# Altium schematic sheet S08.SchDoc: IEEE-1394/Ethernet FPGA Controller
size 381 x 254 mm; Revision: 3.2; SheetNumber: 8; SheetTotal: 10
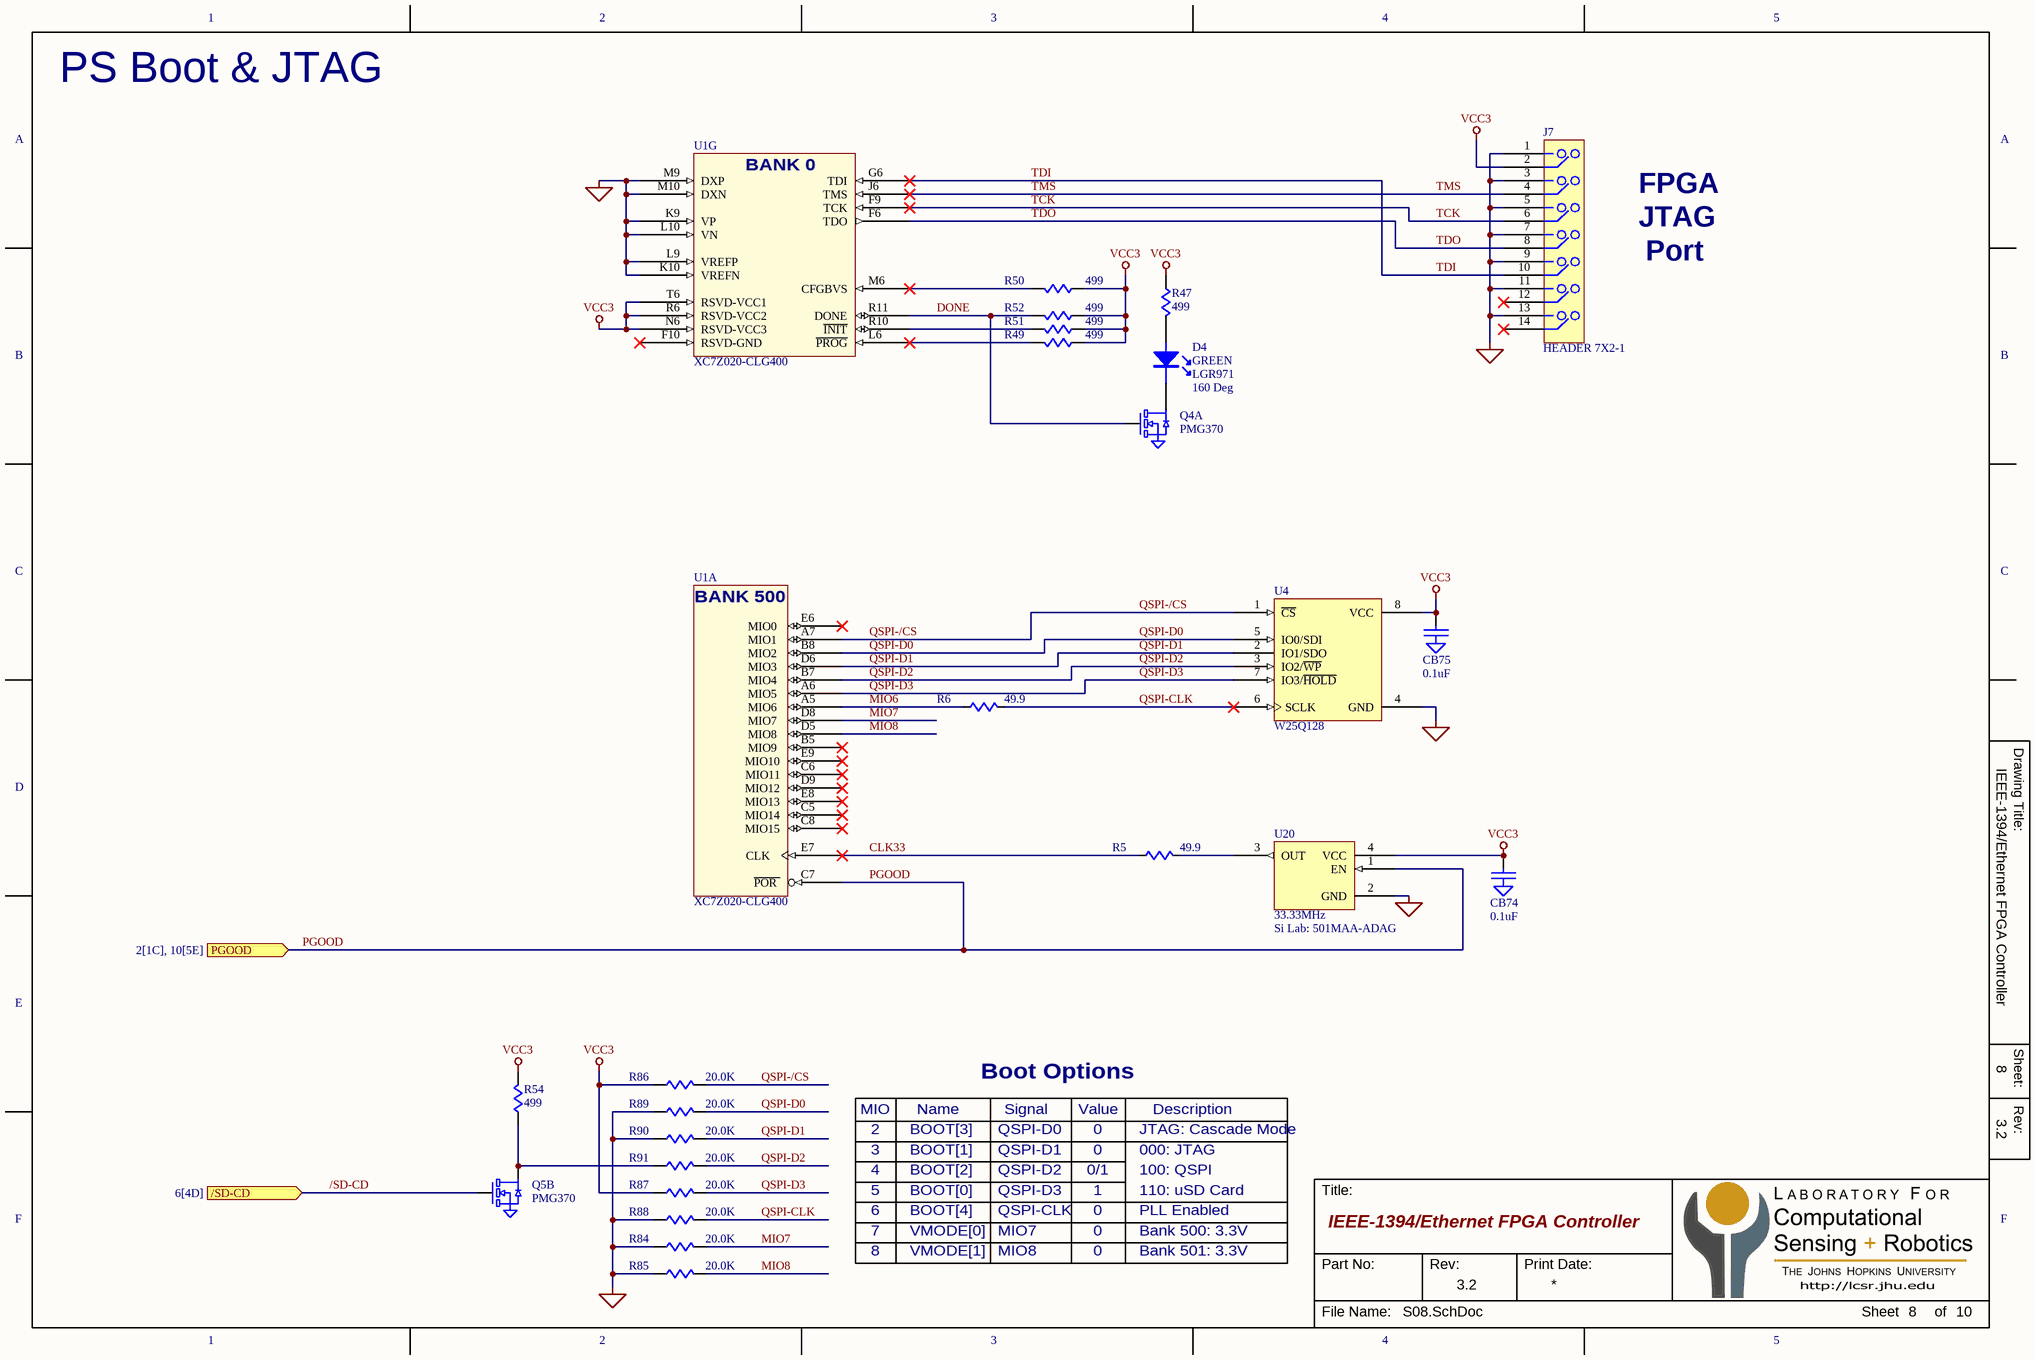
[diagram p0: S08.SchDoc]

## Parts
CB74  0.1uF  [C0201]
CB75  0.1uF  [C0201]
D4  Color: GREEN  P/N: LGR971  Angle: 160 Deg  [LED-0805]  (hidden comment: LED)
J7  HEADER 7X2-1  [HDR-7x2-2MM]
Q4  PMG370  [SC70-6-NP]  (part A of 2)
Q5  PMG370  [SC70-6-NP]  (part B of 2)
R5  49.9  [R0201]
R6  49.9  [R0201]
R47  499  [R0402]
R49  499  [R0402]
R50  499  [R0402]
R51  499  [R0402]
R52  499  [R0402]
R54  499  [R0402]
R84  20.0K  [R0402]
R85  20.0K  [R0402]
R86  20.0K  [R0402]
R87  20.0K  [R0402]
R88  20.0K  [R0402]
R89  20.0K  [R0402]
R90  20.0K  [R0402]
R91  20.0K  [R0402]
U1  XC7Z020-CLG400  [BGA-400-08mm]  (parts A,G of 9)
U4  W25Q128  [SOL-8]
U20  33.33MHz  [OSC-2x2.5mm]

## Ports
/SD-CD (in, see 6[4D]), PGOOD (in, see 2[1C], 10[5E])

## Nets
GND: CB74.2(GND) CB75.2(GND) J7.1 J7.3 J7.5 J7.7 J7.9 J7.11 J7.13 Q4.1(S1) Q5.4(S2) R84.1 R85.1 R88.1 R89.1 R90.1 U1.K9(VP) U1.K10(VREFN) U1.L9(VREFP) U1.L10(VN) U1.M9(DXP) U1.M10(DXN) U4.4(GND) U20.2(GND)
VCC3: CB74.1 CB75.1 J7.2 R47.1 R49.1 R50.1 R51.1 R52.1 R54.2 R86.1 R87.1 U1.N6(RSVD-VCC3) U1.R6(RSVD-VCC2) U1.T6(RSVD-VCC1) U4.8(VCC) U20.4(VCC)
/SD-CD: Q5.5(G2) ; port /SD-CD
CLK33: R5.1 U1.E7(CLK)
DONE: Q4.2(G1) R52.2 U1.R11(DONE)
MIO6: R6.1 U1.A5(MIO6)
MIO7: R84.2 U1.D8(MIO7)
MIO8: R85.2 U1.D5(MIO8)
PGOOD: U1.C7(~{POR_}) U20.1(EN) ; port PGOOD
QSPI-/CS: R86.2 U1.A7(MIO1) U4.1(~{CS})
QSPI-CLK: R6.2 R88.2 U4.6(SCLK)
QSPI-D0: R89.2 U1.B8(MIO2) U4.5(IO0/SDI)
QSPI-D1: R90.2 U1.D6(MIO3) U4.2(IO1/SDO)
QSPI-D2: R91.2 U1.B7(MIO4) U4.3(IO2/~{WP})
QSPI-D3: R87.2 U1.A6(MIO5) U4.7(IO3/~{HOLD})
TCK: J7.6 U1.F9(TCK)
TDI: J7.10 U1.G6(TDI)
TDO: J7.8 U1.F6(TDO)
TMS: J7.4 U1.J6(TMS)
NetD4_1: D4.1(C) Q4.6(D1)
NetD4_2: D4.2(A) R47.2
NetQ5_3: Q5.3(D2) R54.1 R91.1
NetR5_2: R5.2 U20.3(OUT)
NetR49_2: R49.2 U1.L6(~{PROG})
NetR50_2: R50.2 U1.M6(CFGBVS)
NetR51_2: R51.2 U1.R10(~{INIT})

Not connected (* = marked no-connect by the designer): J7 12* 14*; U1 B5(MIO9_)* C5(MIO14)* C6(MIO11)* C8(MIO15)* D9(MIO12)* E6(MIO0_)* E8(MIO13)* E9(MIO10)* F10(RSVD-GND)*

## Notes on the sheet
- PS Boot & JTAG
- FPGA
- JTAG
- Port
- MIO
- Name
- Signal
- Boot Options
- Value
- Description
- 2
- 3
- 4
- BOOT[3]
- BOOT[1]
- BOOT[2]
- QSPI-D0
- QSPI-D1
- QSPI-D2
- 0
- 0/1
- 100: QSPI
- JTAG: Cascade Mode
- 000: JTAG
- 5
- 6
- 7
- BOOT[0]
- BOOT[4]
- VMODE[0]
- QSPI-D3
- QSPI-CLK
- MIO7
- 1
- Bank 500: 3.3V
- 110: uSD Card
- PLL Enabled
- 8
- VMODE[1]
- MIO8
- Bank 501: 3.3V
- A
- B
- C
- Drawing Title:
- D
- E
- Sheet:
- Rev:
- F
- Title:
- Part No:
- Print Date:
- File Name:
- Sheet
- of
- (in symbol OSCILATOR) Si Lab: 501MAA-ADAG
- (in symbol XC7Z020-CLG400, part A) BANK 500
- (in symbol XC7Z020-CLG400, part G) BANK 0

## Library data of the parts
CB74 CB75 = CAP-GND
Q4 Q5 = MOSFET-N-DUAL6
R5 R6 R47 R49-R52 R54 R84-R91 = R
U20 = OSCILATOR